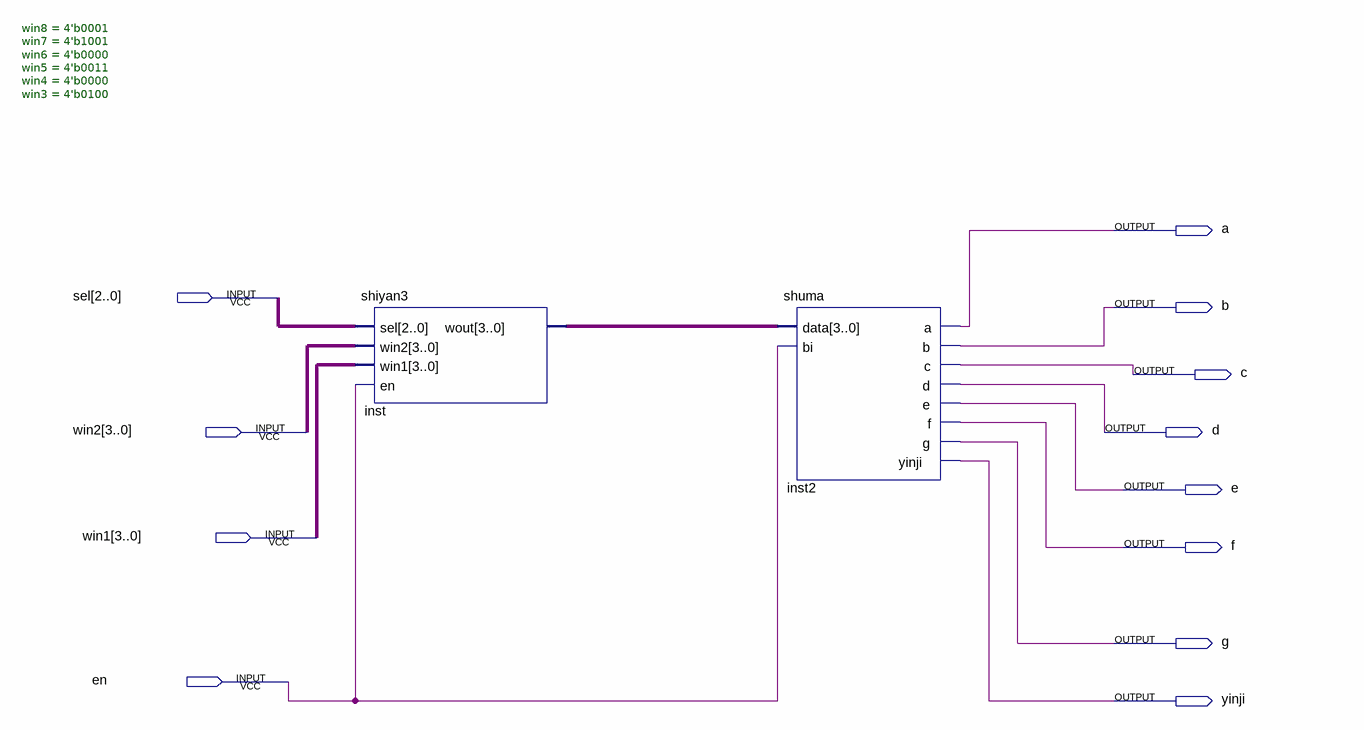
[diagram p0: schematic sheet]
// Quartus schematic Block1.bdf as structural Verilog: 2 symbols, 12 pins
module Block1 (
  input  [2:0] sel,
  input  [3:0] win2,
  input  [3:0] win1,
  input  en,
  output a,
  output b,
  output c,
  output d,
  output e,
  output f,
  output g,
  output yinji
);

  wire [3:0] inst_wout;

  shiyan3 #(.win8(4'b0001), .win7(4'b1001), .win6(4'b0000), .win5(4'b0011), .win4(4'b0000), .win3(4'b0100)) inst (
    .sel(sel), .win2(win2), .win1(win1), .en(en), .wout(inst_wout));
  shuma inst2 (.data(inst_wout), .bi(en), .a(a), .b(b), .c(c), .d(d), .e(e), .f(f), .g(g), .yinji(yinji));
endmodule
